# EAGLE design USBFTDI(I2C_V2) (EAGLE 6.5.0)
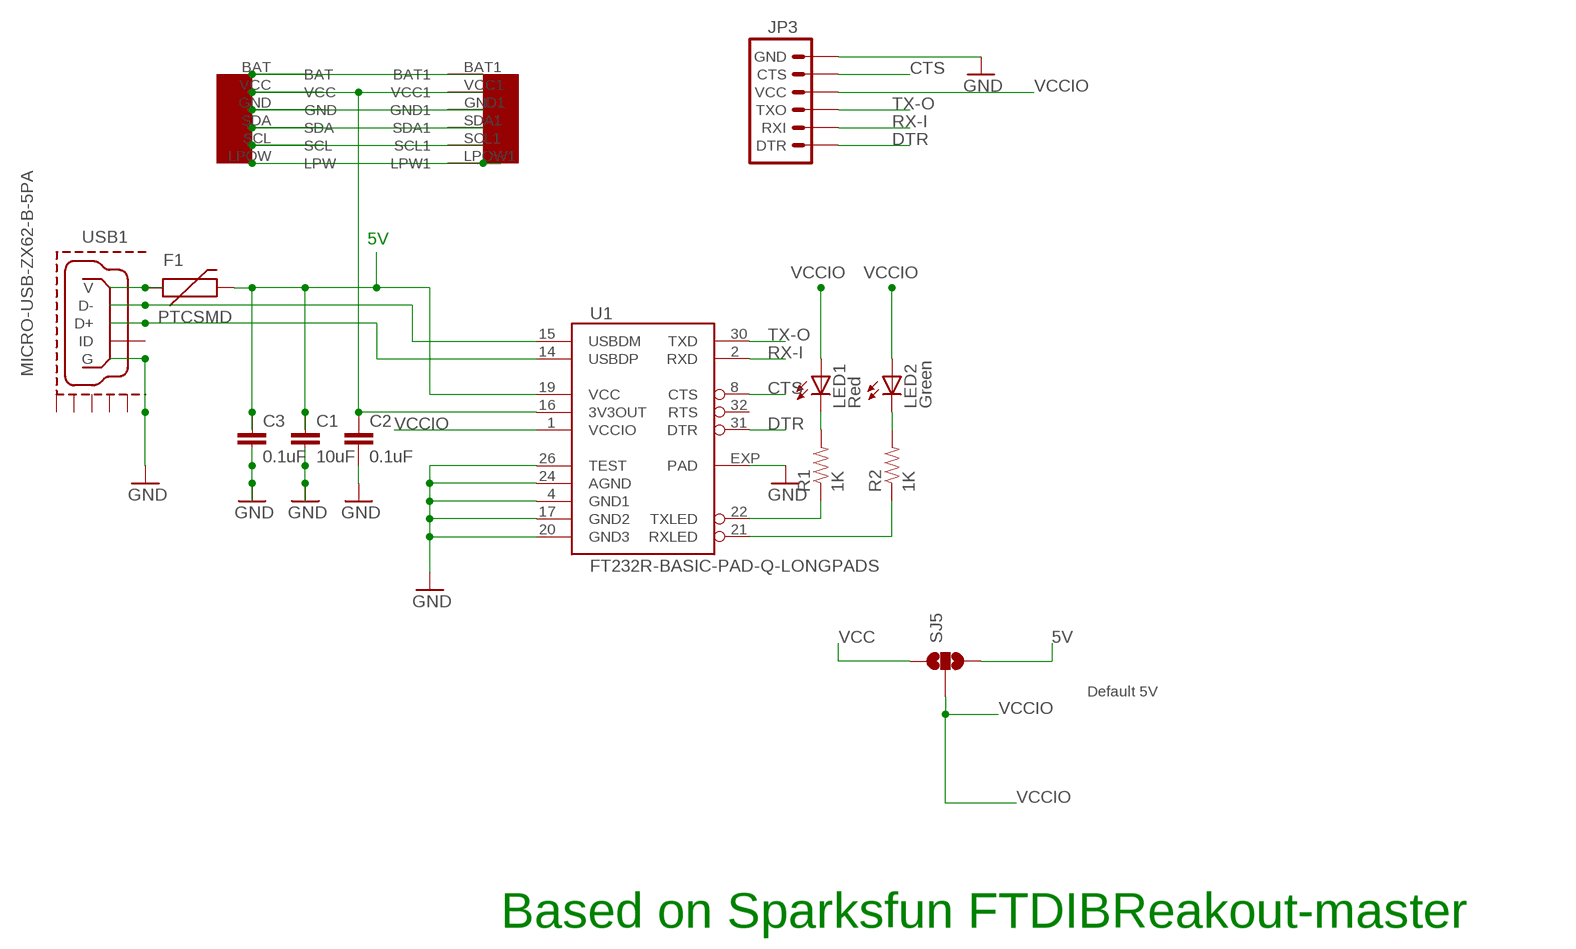
[diagram p0: schematic, sheet 1]

## Parts
C1  10uF  CAP-0402  [0402-CAP]
C2  0.1uF  CAP-0402  [0402-CAP]
C3  0.1uF  CAP-0402  [0402-CAP]
F1  PTCSMD  [PTC-1206]
JP3  ARDUINO_SERIAL_PROGRAMPTH  [1X06]
LED1  Red  LED0603  [LED-0603]
LED2  Green  LED0603  [LED-0603]
R1  1K  RESISTOR-0402  [R0402]
R2  1K  RESISTOR-0402  [R0402]
SJ5  SOLDERJUMPER_2WAY-LEFT-BRIDGED  [SJ-3-LEFT]
U1  FT232R-BASIC-PAD-Q-LONGPADS  [QFN32-LONG]
U$1  EZ-I2CHEADERV1  [EZ-I2CHEADERV1]
USB1  MICRO-USB-ZX62-B-5PA  [ZX62-B-5PA]

## Nets
5V: C1.1 C3.1 F1.2 SJ5.3 U1.19(VCC)
BAT: U$1.BAT U$1.BAT1
CTS: JP3.5(CTS) U1.8(CTS)
DTR: JP3.1(DTR) U1.31(DTR)
GND: C1.2 C2.2 C3.2 JP3.6(GND) U1.4(GND1) U1.17(GND2) U1.20(GND3) U1.24(AGND) U1.26(TEST) U1.EXP(PAD) U$1.GND U$1.GND1 USB1.5(G) USB1.GND@6(GND6)
LPW: U$1.LPOW1(LPW1) U$1.LPOW(LPW)
N$1: U1.14(USBDP) USB1.3(D+)
N$5: U1.15(USBDM) USB1.2(D-)
N$6: R2.1 U1.21(RXLED)
N$7: F1.1 USB1.1(V)
N$9: LED1.C R1.2
N$10: LED2.C R2.2
N$12: R1.1 U1.22(TXLED)
RX-I: JP3.2(RXI) U1.2(RXD)
SCL: U$1.SCL U$1.SCL1
SDA: U$1.SDA U$1.SDA1
TX-O: JP3.3(TXO) U1.30(TXD)
VCC: C2.1 SJ5.1 U1.16(3V3OUT) U$1.VCC U$1.VCC1
VCCIO: JP3.4(VCC) LED1.A LED2.A SJ5.2 U1.1(VCCIO)
Unconnected: U1.32(RTS) USB1.4(ID)

## Notes on the sheet
- 5V
- VCCIO | VCCIO
- Default 5V
- Based on Sparksfun FTDIBReakout-master

## Power pins joined to a net without a drawn wire
GND1: USB1.GND@1(GND1)
GND2: USB1.GND@2(GND2)
GND3: USB1.GND@3(GND3)
GND4: USB1.GND@4(GND4)
GND5: USB1.GND@5(GND5)

## Library data of the parts
C1-C3 = akafugu:CAP: Capacitor Standard 0603 ceramic capacitor, and 0.1" leaded capacitor.
F1 = akafugu:PTC: Resettable Fuse PTC Resettable Fuse. Spark Fun Electronics SKU : COM-08357
JP3 = SparkFun:ARDUINO_SERIAL_PROGRAM
LED1 LED2 = akafugu:LED: LEDs Standard schematic elements and footprints for 5mm, 3mm, 1206, and 0603 sized LEDs. 5mm - Spark Fun Electronics SKU : COM-00529 (and others)
R1 R2 = akafugu:RESISTOR: Resistor Basic schematic elements and footprints for 0603, 1206, and PTH resistors.
SJ5 = akafugu:SOLDERJUMPER_2WAY: Solder Jumper 2 way solder jumper
U1 = akafugu:FT232R-BASIC-PAD
U$1 = UniqueInteractionsLib:EZ-I2CHEADERV1
USB1 = serial:MICRO-USB: MICRO USB B, BOTTOM MOUNT

## Net classes
1 power: width 0.305 mm

## Board
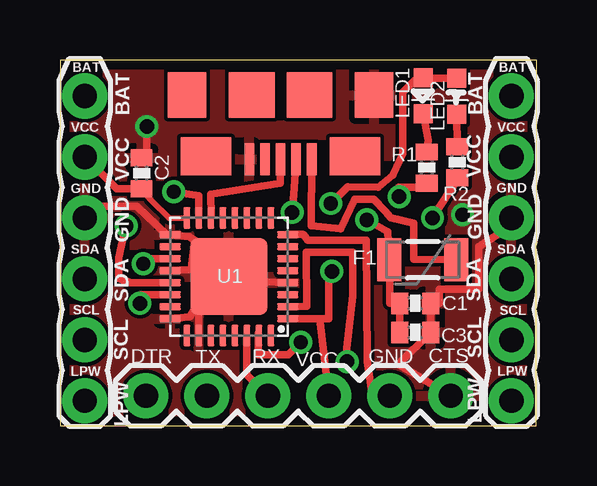
[diagram p1: board, top side]
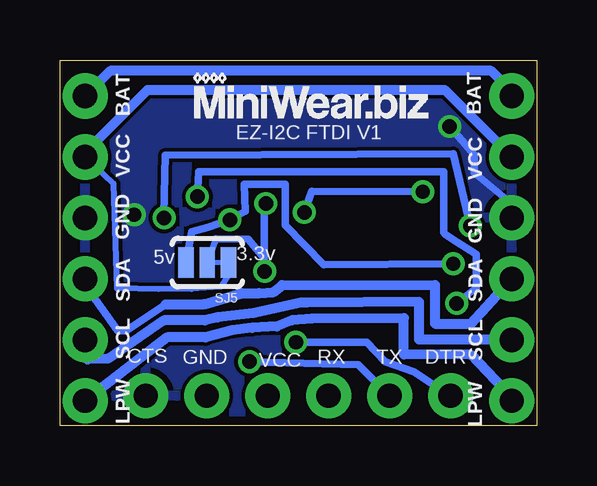
[diagram p2: board, bottom side, seen from below]

Size 19.86 x 15.23 mm. Coordinates in mm from the lower left corner, seen from the top.
Outline: 0,0 19.84,0 19.86,15.23 0,15.21 0,0
Copper layers (1*16): Top 0.0356mm / dielectric 1.5011mm / Bottom 0.0356mm
Design rules "oshParkPCBDesignRules": minimum track width 6mil, minimum drill 13mil, track to track 6mil, track to pad 6mil, pad to pad 6mil, via to via 6mil, smd to smd 6mil, copper to edge 15mil, drill to drill 6mil, minimum pad ring 7mil, minimum via ring 7mil, stop-mask expansion 3mil, vias tented up to drill 0mil, thermal gap 10mil

### Footprints (pad centres in the part's own frame; a part is rotated, then mirrored left to right if it is on the bottom)
0402-CAP = smd 0.7 x 0.9: 1 -0.65,0; 2 0.65,0
PTC-1206 = smd 1 x 1.8: 1 -1.4,0; 2 1.4,0
1X06 = drill 1.016 pad 1.88: 1 0,0; 2 2.54,0; 3 5.08,0; 4 7.62,0; 5 10.16,0; 6 12.7,0
LED-0603 = smd 0.8 x 0.8: A -0.75,0; C 0.75,0
R0402 = smd 0.7 x 0.9: 1 -0.65,0; 2 0.65,0
SJ-3-LEFT = smd 0.635 x 1.27: 1 -0.889,0; 2 0,0; 3 0.889,0
QFN32-LONG = smd 0.9 x 0.3: 1 -2.45,1.75; 2 -2.45,1.25; 3 -2.45,0.75; 4 -2.45,0.25; 5 -2.45,-0.25; 6 -2.45,-0.75; 7 -2.45,-1.25; 8 -2.45,-1.75; 17 2.45,-1.75; 18 2.45,-1.25; 19 2.45,-0.75; 20 2.45,-0.25; 21 2.45,0.25; 22 2.45,0.75; 23 2.45,1.25; 24 2.45,1.75 | smd 0.3 x 0.9: 9 -1.75,-2.45; 10 -1.25,-2.45; 11 -0.75,-2.45; 12 -0.25,-2.45; 13 0.25,-2.45; 14 0.75,-2.45; 15 1.25,-2.45; 16 1.75,-2.45; 25 1.75,2.45; 26 1.25,2.45; 27 0.75,2.45; 28 0.25,2.45; 29 -0.25,2.45; 30 -0.75,2.45; 31 -1.25,2.45; 32 -1.75,2.45 | smd 3.2 x 3.2: EXP 0,0
EZ-I2CHEADERV1 = drill 1.016 pad 1.88: BAT 0,-1.27; BAT1 17.78,-1.27; GND 0,-6.35; GND1 17.78,-6.35; LPOW 0,-13.97; LPOW1 17.78,-13.97; SCL 0,-11.43; SCL1 17.78,-11.43; SDA 0,-8.89; SDA1 17.78,-8.89; VCC 0,-3.81; VCC1 17.78,-3.81
ZX62-B-5PA = smd 0.4 x 1.35: 1 -1.3,2.675; 2 -0.65,2.675; 3 0,2.675; 4 0.65,2.675; 5 1.3,2.675 | smd 2.1 x 1.6: GND@1 -3.1,2.55; GND@2 3.1,2.55 | smd 1.6 x 1.9: GND@3 3.9,0; GND@6 -3.9,0 | smd 1.9 x 1.9: GND@4 1.2,0; GND@5 -1.2,0

### Placement (x,y rotation side)
C1  14.8,5.09 0 top
C2  3.4,10.51 90 top
C3  14.8,3.88 0 top
F1  15.11,6.91 180 top
JP3  3.58,1.24 0 top
LED1  15.13,13.74 270 top
LED2  16.53,13.72 270 top
R1  15.28,10.75 90 top
R2  16.55,10.97 90 top
SJ5  13.72,6.79 180 bottom
U1  7.04,6.2 180 top
U$1  1.03,15 0 top
U$3  [LOGO2]  14.38,12.62 0 bottom
USB1  9.19,13.77 180 top

### Tracks (layer width: path | path; a pad name or v marks a point on that pad's centre or on a via)
5V  (via drill 0.6)
  Top 0.305: C3.1 C1.1 13.73,5.1 F1.2 13.65,8.08 v12.78,8.57 | U1.19 3.72,6.95 v3.47,6.74
  Bottom 0.305: v3.47,6.74 8.87,6.69 10.48,8.35 10.48,9.57 10.47,10.05 12.17,10.05 12.14,8.93 v12.78,8.57 13.68,8.27 14.36,8.07 SJ5.3
BAT
  Bottom 0.406: U$1.BAT 1.03,13.92 1.89,14.78 17.76,14.78 U$1.BAT1
CTS
  Top 0.305: JP3.5 13.04,1.14 12.81,2.68 12.77,7.71 10.32,7.73 10.15,7.95 10.1,7.96 9.54,7.96 U1.8
DTR  (via drill 0.6)
  Top 0.305: U1.31 8.26,3.85 8.26,2.94 9.5,2.94 v10.03,3.47
  Bottom 0.305: v10.03,3.47 7.08,3.47 6.3,2.66 5.11,2.25 3.69,1.3 JP3.1
GND  (via drill 0.6)
  Top 0.305: U1.4 7.04,6.05 U1.EXP | U1.20 5.37,6.48 | 5.37,6.48 7.04,6.55 U1.EXP | U1.24 5.41,4.53 5.62,4.88 | 5.62,4.88 U1.EXP | U1.26 5.79,4.72 5.62,4.88 | JP3.6 14.1,2.55 C3.2 C1.2 15.8,5.09 15.81,5.68 17.45,5.67 17.44,7.44 18.81,8.32 U$1.GND1 | v3.62,12.46 3.62,11.18 C2.2 | U$1.GND 1.49,9.14 3.2,9.14 4.44,7.95 U1.17 5.38,7.87 5.62,7.71 5.47,6.55 5.37,6.48
  Bottom 0.305: U$1.GND 1.03,9.25 2.6,10.53 2.6,11.29 v3.62,12.46
  other vias: 16.77,8.78
  pour Bottom: -0.82,15.95 20.96,16.07 21.78,-0.83 -0.9,-0.79
  pour Top: 0.14,-0.12 0.07,15.14 22.96,15.4 22.94,-0.09
LPW
  Bottom 0.406: U$1.LPOW 1.03,1.16 2.72,2.94 5.53,2.96 5.53,4.47 9.36,4.45 10.2,4.38 10.81,4.13 11.86,4.07 12.67,3.98 13.79,3.67 15.39,3.67 U$1.LPOW1
N$1
  Top 0.305: USB1.3 9.18,10.1 6.29,9.63 6.3,8.75 U1.14
N$5  (via drill 0.6)
  Top 0.305: USB1.2 9.76,9.91 v9.67,8.88 | v4.74,9.74 5.79,9.57 U1.15
  Bottom 0.305: v9.67,8.88 9.37,9.76 v4.74,9.74
N$6  (via drill 0.6)
  Top 0.305: U1.21 2.93,5.95 2.45,6.14 2.44,7 2.69,8.13 v2.76,8.32 | v15.52,8.65 16.62,10.32 R2.1
  Bottom 0.305: v2.76,8.32 3.46,11.32 15.47,11.27 15.53,8.78 v15.52,8.65
N$7
  Top 0.305: F1.1 14.74,6.92 14.73,8.42 13.78,8.66 13.56,8.92 13.07,9.42 12.28,9.42 11.69,8.2 10.47,8.32 USB1.1
N$9
  Top 0.305: LED1.C 15.34,11.88 R1.2
N$10
  Top 0.305: R2.2 LED2.C
N$12  (via drill 0.6)
  Top 0.305: U1.22 3.37,5.45 3.31,5.39 3.31,5.17 v3.33,5.09 | v14.13,9.54 14.1,9.37 14.12,9.92 15.11,9.92 R1.1
  Bottom 0.305: v3.33,5.09 2.52,5.74 2.52,7.14 3.53,7.79 3.8,7.98 3.86,8.05 3.86,10.57 14.07,10.57 v14.13,9.54
RX-I  (via drill 0.6)
  Top 0.305: v11.96,2.66 11.94,3.21 12.2,5.4 12.2,7.21 10.27,7.22 10.28,4.97 U1.2
  Bottom 0.305: v11.96,2.66 7.42,2.54 JP3.2
SCL
  Bottom 0.406: U$1.SCL 4.89,3.58 4.89,5.15 9.56,5.12 9.82,5.12 11.8,4.68 13.29,4.51 13.81,4.38 15.53,4.38 17.85,2.79 18.71,2.76 U$1.SCL1
SDA
  Bottom 0.305: 18.8,5.84 17.44,3.94 17.1,3.94 15.45,5.05
  Bottom 0.406: U$1.SDA1 18.8,5.84 | 15.45,5.05 13.85,5.06 12.29,5.52 11.56,5.52 10.96,5.56 10.6,5.85 4.24,5.86 4.24,4.25 2.75,4.24 U$1.SDA
TX-O
  Top 0.305: U1.30 7.79,2.11 JP3.3
VCC
  Top 0.254: C2.1 3.75,9.43 3.79,9.39 4.55,8.64 U1.16
  Top 0.305: C2.1 2.36,9.86 U$1.VCC
  Bottom 0.254: U$1.VCC1 17.62,10.08 17.47,5.71 15.76,5.68 14.37,5.69 13.15,5.79 12.84,6.26 SJ5.1
  Bottom 0.406: U$1.VCC1 18.81,11.38 16.2,13.99 3.83,13.99 U$1.VCC
VCCIO  (via drill 0.6)
  Top 0.305: v11.28,9.25 11.99,9.94 13.25,9.93 13.86,10.43 14.28,11.33 14.28,13.88 14.79,14.39 15.03,14.39 LED1.A 15.15,14.47 LED2.A | v11.33,6.42 11.2,6.4 11.2,4.45 10.83,4.45 | U1.1 10.83,4.45 | JP3.4 10.83,4.45
  Bottom 0.254: 13.37,7.78 SJ5.2
  Bottom 0.305: v11.28,9.25 11.34,9.24 11.34,6.97 | 11.34,6.97 11.33,6.69 v11.33,6.42 | 11.34,6.97 12.02,7.77 13.37,7.78

### Text on the board
tNames: DTR | TX | RX | VCC | GND | CTS
bNames: EZ-I2C FTDI V1 | 3.3v | 5v | DTR | TX | RX | VCC | GND | CTS